# EAGLE design ATEM_TALLY_BOARD_102912 (EAGLE 6.2)
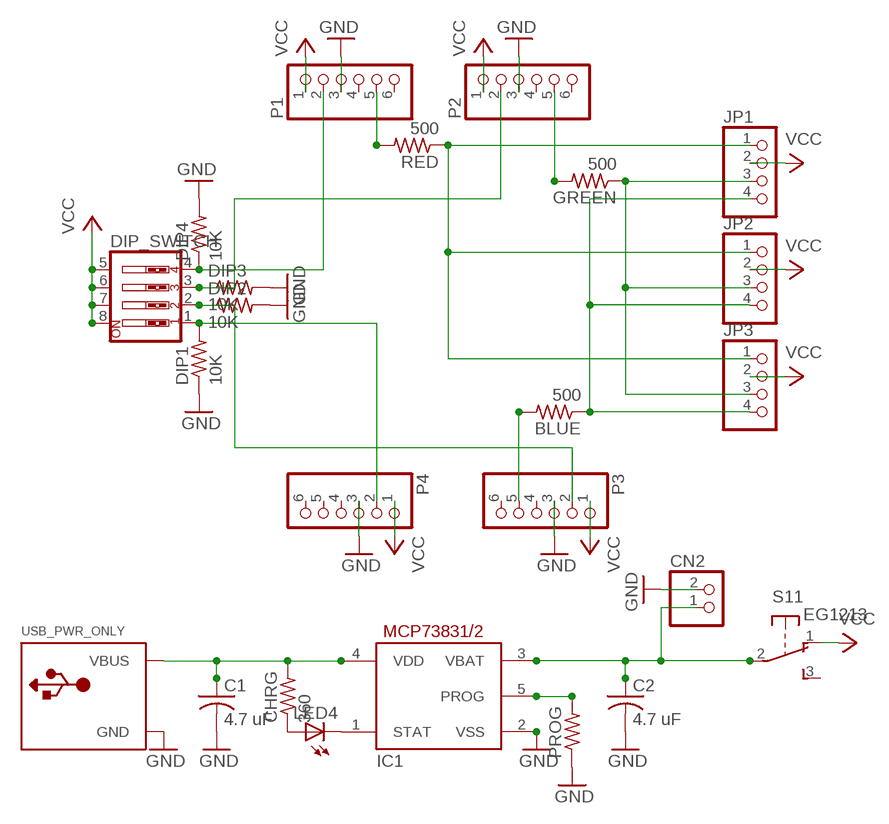
[diagram p0: schematic, sheet 1]

## Parts
BLUE  500  R-US_R0805  [R0805]
C1  4.7 uF  C-USC0805K  [C0805K]
C2  4.7 uF  C-USC0805K  [C0805K]
CHRG  360  R-US_R0805  [R0805]
CN2  JST_2PIN-SMT-RA  [JST-PH-2-SMT-RA]
DIP1  10K  R-US_R0805  [R0805]
DIP2  10K  R-US_R0805  [R0805]
DIP3  10K  R-US_R0805  [R0805]
DIP4  10K  R-US_R0805  [R0805]
DIP_SWITCH  SW_DIP-4  [EDG-04]
GREEN  500  R-US_R0805  [R0805]
IC1  MCP73831/OT  [SOT23-5L]
JP1  PINHD-1X4  [1X04]
JP2  PINHD-1X4  [1X04]
JP3  PINHD-1X4  [1X04]
LED4  LED3MM  [LED3MM]
P1  PINHD-1X6CB  [1X06-CLEANBIG]
P2  PINHD-1X6CB  [1X06-CLEANBIG]
P3  PINHD-1X6CB  [1X06-CLEANBIG]
P4  PINHD-1X6CB  [1X06-CLEANBIG]
PROG  R-US_R0805  [R0805]
RED  500  R-US_R0805  [R0805]
S1  EG1213  [EG1213]
USB_PWR_ONLY  USB-PWR-NOSILK  [USB-MINIB-THM-MOLEX-PWRONLY-NOSILK]

## Nets
BLUE: BLUE.1 JP1.4 JP2.4 JP3.4
GND: C1.2 C2.2 CN2.2 DIP1.1 DIP2.2 DIP3.2 DIP4.2 IC1.2(VSS) P1.3 P2.3 P3.3 P4.3 PROG.1 USB_PWR_ONLY.GND
GREEN: GREEN.1 JP1.3 JP2.3 JP3.3
N$1: P1.5 RED.2
N$3: GREEN.2 P2.5
N$5: BLUE.2 P3.5
N$7: C1.1 CHRG.2 IC1.4(VDD) USB_PWR_ONLY.VBUS
N$8: DIP4.1 DIP_SWITCH.4 P1.2
N$9: DIP3.1 DIP_SWITCH.3 P2.2
N$10: DIP2.1 DIP_SWITCH.2 P3.2
N$11: DIP1.2 DIP_SWITCH.1 P4.2
N$12: IC1.1(STAT) LED4.K(C)
N$13: CHRG.1 LED4.A
N$14: IC1.5(PROG) PROG.2
N$15: C2.1 CN2.1 IC1.3(VBAT) S1.2(1:P)
RED: JP1.1 JP2.1 JP3.1 RED.1
VCC: DIP_SWITCH.5 DIP_SWITCH.6 DIP_SWITCH.7 DIP_SWITCH.8 JP1.2 JP2.2 JP3.2 P1.1 P2.1 P3.1 P4.1 S1.1(1:O)
Unconnected: P1.4 P1.6 P2.4 P2.6 P3.4 P3.6 P4.4 P4.5 P4.6 S1.3(1:S) S1.MT1(MT) S1.MT2(MT)

## Library data of the parts
BLUE CHRG DIP1-DIP4 GREEN PROG RED = adafruit:R-US_: RESISTOR, American symbol
C1 C2 = adafruit:C-US: CAPACITOR, American symbol
CN2 = adafruit:JST_2PIN: JST 2-Pin Connectors of various flavors SMT-RA (S2B-PH-SM4) 4UConnector #17311 SMT (B2B-PH-SM4) THM-RA (S2B-PH) THM (B2B-PH)
DIP_SWITCH = special:SW_DIP-4: DIP SWITCH
IC1 = adafruit:MCP73831: MCP73831/2 Miniature Single-Cell, Fully Integrated Li-Ion, Li-Polymer Charge Management Controllers. Nice and small simple lipoly charge controller, with adjustable current and status output (LED) http://www.ladyada.net/library/pcb/eaglelibrary.html
JP1-JP3 = pinhead:PINHD-1X4: PIN HEADER
LED4 = adafruit:LED: LED OSRAM: - CHIPLED LG R971, LG N971, LY N971, LG Q971, LY Q971, LO R971, LY R971 LH N974, LH R974 LS Q976, LO Q976, LY Q976 LO Q996 - Hyper CHIPLED LW Q18S LB Q993, LB Q99A, LB R99A - SideLED LS A670, LO A670, LY A670, LG A670, LP A670 LB A673, LV A673, LT A673, LW A673 LH A674 LY A675 LS A676, LA A676, LO A676, LY A676, LW A676 LS A679, LY A679, LG A679 - Hyper Micro SIDELED® LS Y876, LA Y876, LO Y876, LY Y876 LT Y87S - SmartLED LW L88C, LW L88S LB L89C, LB L89S, LG L890 LS L89K, LO L89K, LY L89K LS L896, LA L896, LO L896, LY L896 - TOPLED LS T670, LO T670, LY T670, LG T670, LP T670 LSG T670, LSP T670, LSY T670, LOP T670, LYG T670 LG T671, LOG T671, LSG T671 LB T673, LV T673, LT T673, LW T673 LH T674 LS T676, LA T676, LO T676, LY T676, LB T676, LH T676, LSB T676, LW T676 LB T67C, LV T67C, LT T67C, LS T67K, LO T67K, LY T67K, LW E67C LS E67B, LA E67B, LO E67B, LY E67B, LB E67C, LV E67C, LT E67C LW T67C LS T679, LY T679, LG T679 LS T770, LO T770, LY T770, LG T770, LP T770 LB T773, LV T773, LT T773, LW T773 LH T774 LS E675, LA E675, LY E675, LS T675 LS T776, LA T776, LO T776, LY T776, LB T776 LHGB T686 LT T68C, LB T68C - Hyper Mini TOPLED® LB M676 - Mini TOPLED Santana® LG M470 LS M47K, LO M47K, LY M47K Source: http://www.osram.convergy.de/
P1-P4 = adafruit:PINHD-1X6: PIN HEADER
S1 = adafruit:EG1213: E-Switch right-angle slide SPDT Part #EG1213 http://www.ladyada.net/library/eagle
USB_PWR_ONLY = adafruit:USB-PWR-NOSILK

## Board
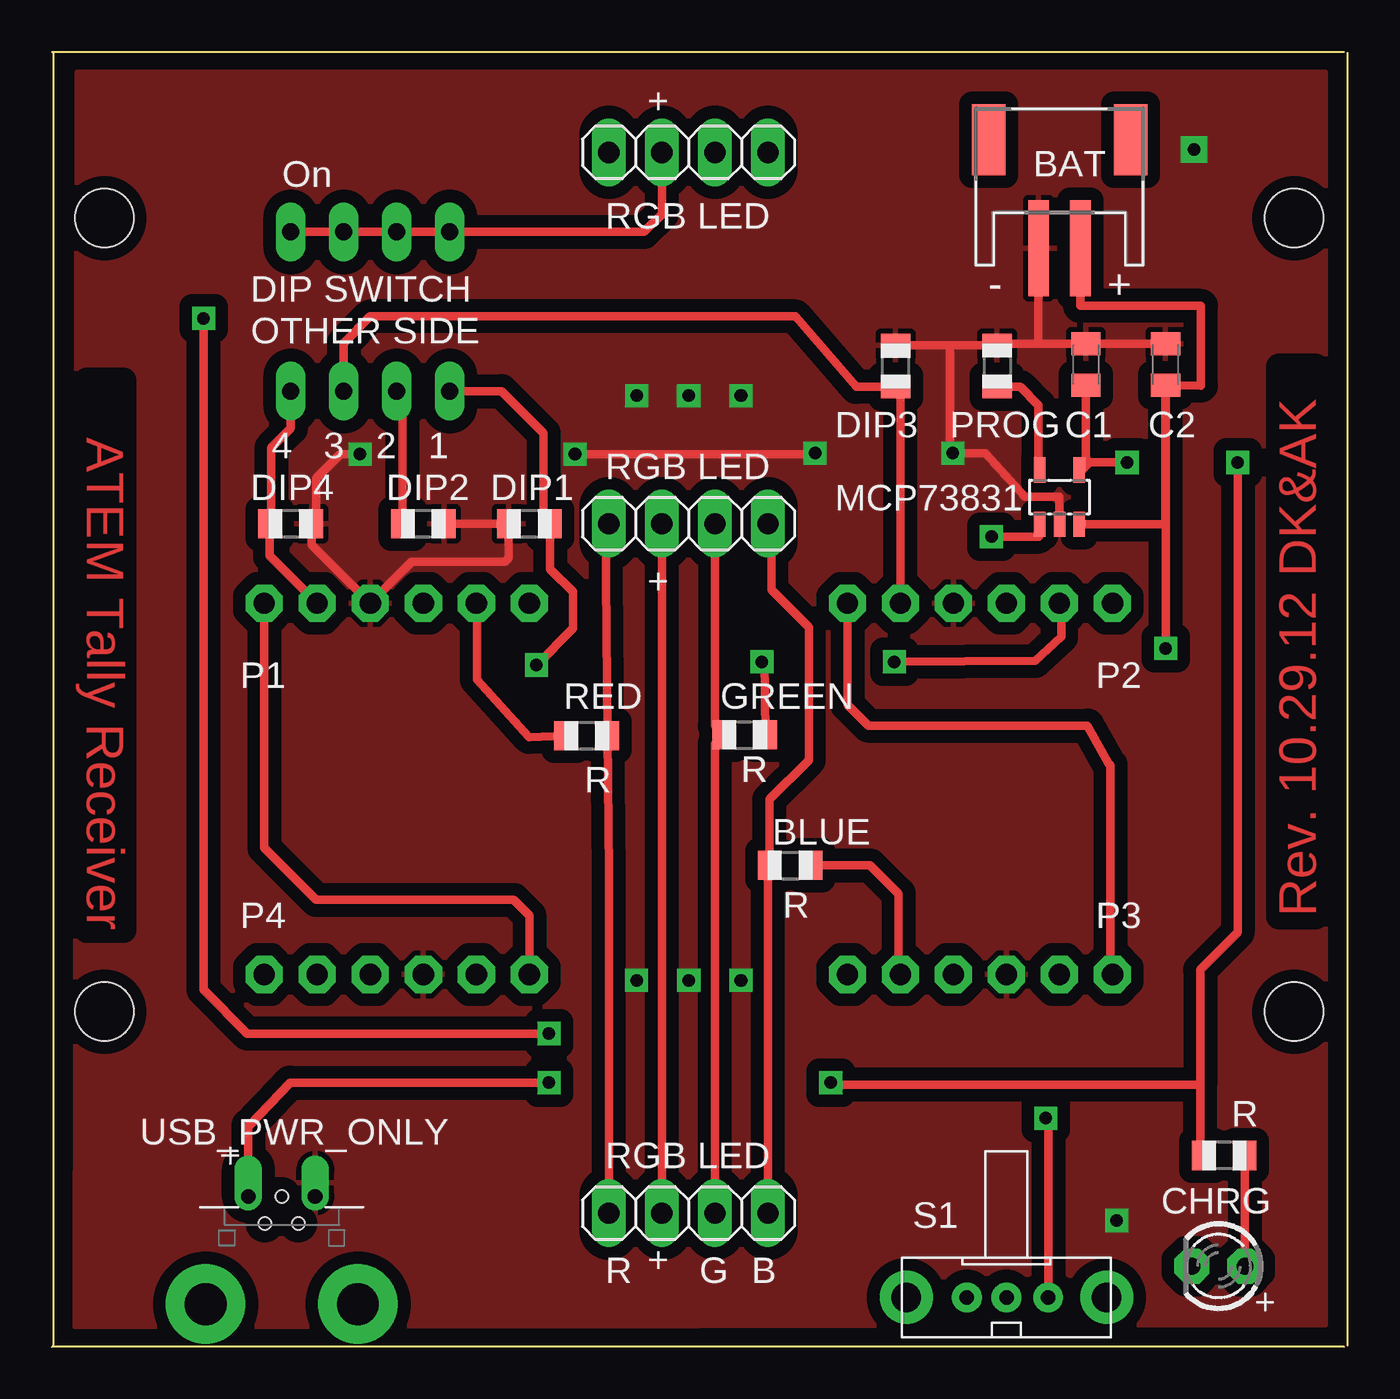
[diagram p1: board, top side]
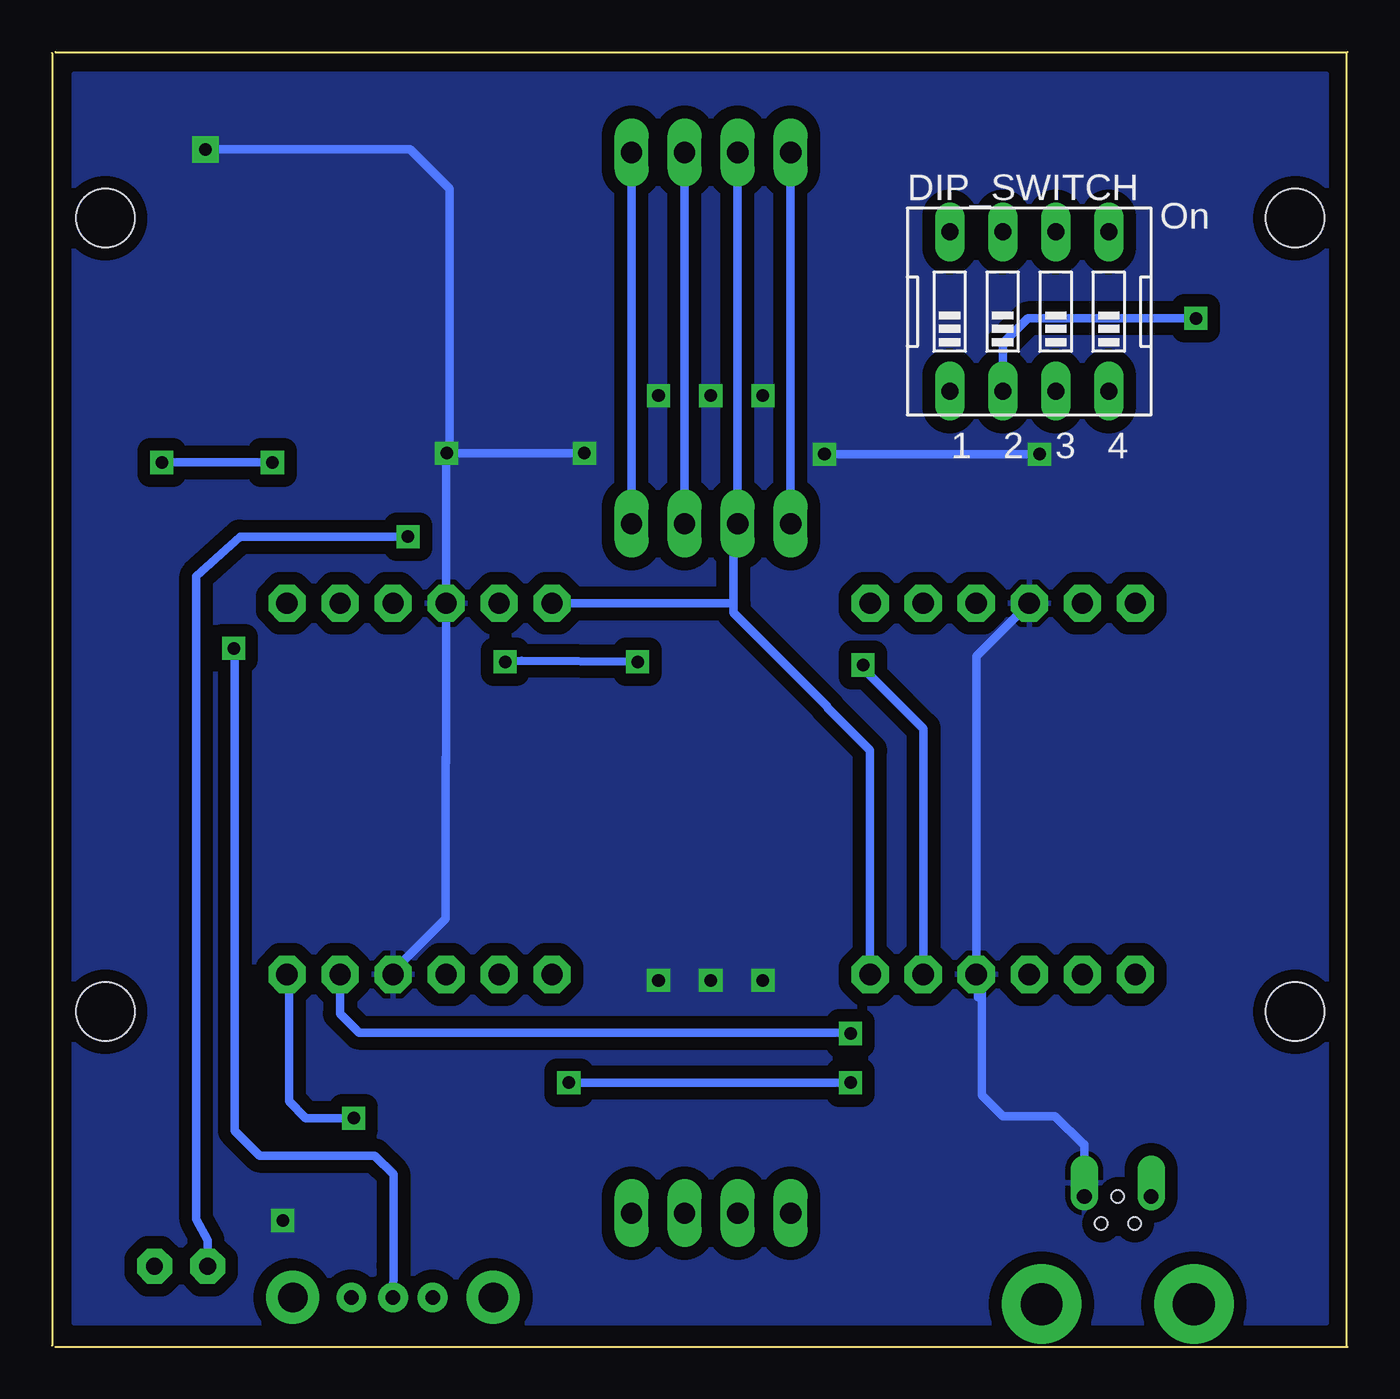
[diagram p2: board, bottom side, seen from below]

Size 62.05 x 62 mm. Coordinates in mm from the lower left corner, seen from the top.
Outline: 61.9,62 0,62
Outline: 61.9,0 0,0
Outline: 62.05,61.95 62.05,0.05
Outline: 0.05,61.95 0.05,0.05
Copper layers (1*16): Top 0.035mm / dielectric 1.5mm / Bottom 0.035mm
Design rules: minimum track width 10mil, minimum drill 20mil, track to track 10mil, track to pad 10mil, pad to pad 10mil, via to via 10mil, smd to smd 10mil, copper to edge 10mil, drill to drill 10mil, minimum pad ring 12mil, minimum via ring 10mil, stop-mask expansion 4mil, vias tented up to drill 25mil, thermal gap 10mil
Holes 2.8 mm at 2.5,54.05 2.5,16.05 59.5,16.05 59.5,54.05

### Footprints (pad centres in the part's own frame; a part is rotated, then mirrored left to right if it is on the bottom)
R0805 = smd 1.1 x 1.4: 1 -1,0; 2 1,0
C0805K = smd 1.1 x 1.4: 1 -1,0; 2 1,0
JST-PH-2-SMT-RA = smd 1 x 4.6: 1 1,-3.7; 2 -1,-3.7 | smd 1.6 x 3.4: NC1 -3.4,1.5; NC2 3.4,1.5
EDG-04 = drill 0.813 long: 1 -3.81,-3.81; 2 -1.27,-3.81; 3 1.27,-3.81; 4 3.81,-3.81; 5 3.81,3.81; 6 1.27,3.81; 7 -1.27,3.81; 8 -3.81,3.81
SOT23-5L = smd 0.55 x 1.2: 1 -0.95,-1.3; 2 0,-1.3; 3 0.95,-1.3; 4 0.95,1.3; 5 -0.95,1.3
1X04 = drill 1.016 long: 1 -3.81,0; 2 -1.27,0; 3 1.27,0; 4 3.81,0
LED3MM = drill 0.813 pad 1.676 octagon: A -1.27,0; K 1.27,0
1X06-CLEANBIG = drill 1.016 pad 1.778 octagon: 1 -6.35,0; 2 -3.81,0; 3 -1.27,0; 4 1.27,0; 5 3.81,0; 6 6.35,0
EG1213 = drill 0.7 pad 1.422: 1 -2,0; 2 0,0; 3 1.9,0 | drill 1.4 pad 2.54: MT1 -4.8,0; MT2 4.8,0
USB-MINIB-THM-MOLEX-PWRONLY-NOSILK = drill 0.7 offset: GND 1.6,4.64; VBUS -1.6,4.64 | drill 2 pad 3.81: GND1 -3.65,-0.51; GND4 3.65,-0.51 | hole 0.6: 0,4.648; 0.787,3.353; -0.813,3.353

### Placement (x,y rotation side)
BLUE  35.36,23.06 0 top
C1  49.53,47.04 90 top
C2  53.34,47.04 90 top
CHRG  56.15,9.16 180 top
CN2  48.26,56.3 0 top
DIP1  22.86,39.42 0 top
DIP2  17.78,39.42 0 top
DIP3  40.41,46.97 90 top
DIP4  11.43,39.42 0 top
DIP_SWITCH  15.24,49.58 0 bottom
GREEN  33.18,29.31 0 top
IC1  48.26,40.69 0 top
JP1  30.48,6.4 0 top
JP2  30.48,39.42 0 top
JP3  30.48,57.2 0 top
LED4  55.88,3.86 180 top
P1  16.51,35.61 0 top
P2  44.45,35.61 0 top
P3  44.45,17.83 180 top
P4  16.51,17.83 180 top
PROG  45.27,46.97 270 top
RED  25.6,29.26 180 top
S1  45.72,2.36 180 top
USB_PWR_ONLY  11,2.55 0 top

### Tracks (layer width: path | path; a pad name or v marks a point on that pad's centre or on a via)
BLUE
  Top 0.406: JP1.4 34.29,22.99 BLUE.1 34.36,26.21 36.25,28.1 36.25,34.45 34.45,36.25 34.45,39.26 JP2.4
  Bottom 0.406: JP2.4 JP3.4
GND  (via drill 0.6, 0.6 pad 1.27)
  Top 0.406: C2.2 C1.2 47.25,48.04 47.26,48.05 47.26,48.2 | v25.05,42.75 36.4,42.75 v36.55,42.8 | DIP2.2 DIP1.1 21.86,37.76 21.7,37.6 17.23,37.6 P1.3 12.43,38.42 DIP4.2 12.65,39.64 12.65,41.6 13.8,42.75 v14.75,42.75 | CN2.2 47.26,48.2 | 44.72,48.04 47.1,48.04 47.26,48.2 | PROG.1 43.07,47.97 | 43.07,47.97 43,47.9 43,42.9 v43.15,42.8 44.7,42.8 46.6,40.7 48.25,40.7 IC1.2 | DIP3.2 43.07,47.97
  Bottom 0.406: 43.18,28.25 P2.3 43.18,42.72 v43.15,42.8 | 43.18,28.25 43.18,27.97 | P3.3 45.45,18.1 45.45,18.25 43.2,20.5 43.2,28.23 43.18,28.25 | v14.75,42.75 v25.05,42.75 | v36.55,42.8 v43.15,42.8 | P4.3 17.78,33.07 P1.3 | P4.3 17.7,17.75 17.7,16.75 | v54.7,57.35 44.9,57.35 43,55.45 43,42.95 v43.15,42.8 | P4.3 17.5,17.55 17.5,12.05 16.5,11.05 14,11.05 12.65,9.7 12.6,9.7 USB_PWR_ONLY.GND
  other vias: 28,17.55 30.5,17.55 33,17.55 28,45.55 30.5,45.55 33,45.55 51,6.05
  pour Bottom (isolate 0.61): 1,1.15 61,1.15 61,60.95 1,60.95
  pour Top (isolate 0.61): 61,1.05 61,61.05 1.2,61.05 1.1,0.95
GREEN
  Top 0.406: JP1.3 31.75,28.88 GREEN.1 31.75,29.74 JP2.3
  Bottom 0.406: JP2.3 JP3.3
N$1
  Top 0.406: RED.2 22.85,29.2 20.35,31.95 20.35,35.58 P1.5
N$3  (via drill 0.6)
  Top 0.406: GREEN.2 34.13,32.97 v34,32.8 | v40.35,32.8 47.1,32.85 48.35,34 48.35,35.52 P2.5
  Bottom 0.406: v34,32.8 39.55,32.85 v40.35,32.8
N$5
  Top 0.406: BLUE.2 39.19,23.06 40.55,21.7 40.55,17.92 P3.5
N$7  (via drill 0.6)
  Top 0.406: C1.1 49.53,42.31 | v51.5,42.35 49.57,42.35 | v23.8,12.65 11.4,12.65 9.45,10.6 9.4,10.6 USB_PWR_ONLY.VBUS | v56.8,42.35 56.8,19.85 55,18.05 55,12.55 | CHRG.2 55,9.31 55,12.55 | 55,12.55 37.4,12.55 v37.3,12.65
  Top 0.61: 49.53,42.31 IC1.4 | 49.37,42.15 IC1.4 | 49.57,42.35 IC1.4
  Bottom 0.406: v56.8,42.35 v51.5,42.35 | v23.8,12.65 v37.3,12.65
N$8
  Top 0.406: P1.2 10.43,37.88 DIP4.1 10.5,39.49 10.5,43.05 11.43,43.98 DIP_SWITCH.4
N$9
  Top 0.406: DIP_SWITCH.3 13.97,48.07 15.24,49.35 35.6,49.35 38.53,45.97 DIP3.1 40.64,45.74 P2.2
N$10  (via drill 0.6)
  Top 0.406: DIP2.1 16.78,45.5 DIP_SWITCH.2 | v7.25,49.25 7.25,17.1 9.35,15 v23.8,15
  Bottom 0.406: P3.2 48.26,15.96 47.35,15.05 23.85,15.05 v23.8,15 | v7.25,49.25 15.3,49.25 16.5,48.05 DIP_SWITCH.2
N$11  (via drill 0.6)
  Top 0.406: DIP_SWITCH.1 21.53,45.77 23.55,43.75 23.55,39.73 DIP1.2 23.86,37.24 24.95,36.15 24.95,34.4 v23.2,32.65
  Bottom 0.406: v23.2,32.65 23.2,32.5 20.3,29.6 20.3,19.25 P4.2
N$12  (via drill 0.6)
  Top 0.406: v45,38.8 47.27,38.8 IC1.1
  Bottom 0.406: LED4.K 54.61,5.11 55.15,6.1 55.15,36.9 53.05,38.8 v45,38.8
N$13
  Top 0.406: CHRG.1 LED4.A
N$14
  Top 0.406: PROG.2 46.38,45.97 47.25,45.1 47.25,42.05 IC1.5
N$15  (via drill 0.6)
  Top 0.406: IC1.3 53.34,39.39 C2.1 | C2.1 55.04,46.03 55.04,49.85 49.25,49.85 CN2.1 | v53.35,33.45 C2.1
  Bottom 0.406: v53.35,33.45 53.3,33.4 53.3,10.35 52.1,9.15 46.6,9.15 45.7,8.25 45.7,3.88 S1.2
RED
  Top 0.406: JP2.1 26.5,39.25 RED.1 26.67,22.74 JP1.1
  Bottom 0.406: JP2.1 JP3.1
VCC  (via drill 0.6)
  Top 0.406: 23.03,18 P4.1 22.86,20.65 22.11,21.4 12.65,21.4 10.16,23.89 P1.1 | DIP_SWITCH.5 DIP_SWITCH.6 DIP_SWITCH.7 DIP_SWITCH.8 28.35,53.39 29.21,54.25 JP3.2 | JP1.2 JP2.2 | v47.6,10.95 47.5,10.85 47.72,10.85 S1.1 | P2.1 38.1,30.75 39.1,29.75 49.6,29.75 50.6,27.95 50.7,27.85 50.7,17.93 P3.1
  Bottom 0.406: P4.1 22.86,28.56 24.9,30.6 24.9,30.65 29.4,35.15 29.4,35.55 | 29.4,35.55 29.4,39.23 JP2.2 JP3.2 | P2.1 29.46,35.61 29.4,35.55 | v47.6,10.95 49.9,10.95 50.7,11.75 50.7,17.73 P3.1

### Text on the board
Top: Rev. 10.29.12 DK&AK | ATEM Tally Receiver
tPlace: + | On | BAT | RGB LED | DIP SWITCH | OTHER SIDE | DIP3 | PROG | C1 | C2 | 4 | 3 | 2 | 1 | RGB LED | DIP4 | DIP2 | DIP1 | MCP73831 | + | P1 | P2 | RED | GREEN | R | R | R | BLUE | P4 | R | P3 | R | + | RGB LED | + | R | G | B
bPlace: On | 4 | 3 | 2 | 1